# EasyEDA schematic Quadv4.json
TITLE: Quadruped Robot Main Controller; REV: 4.0; Sheet: 1/1
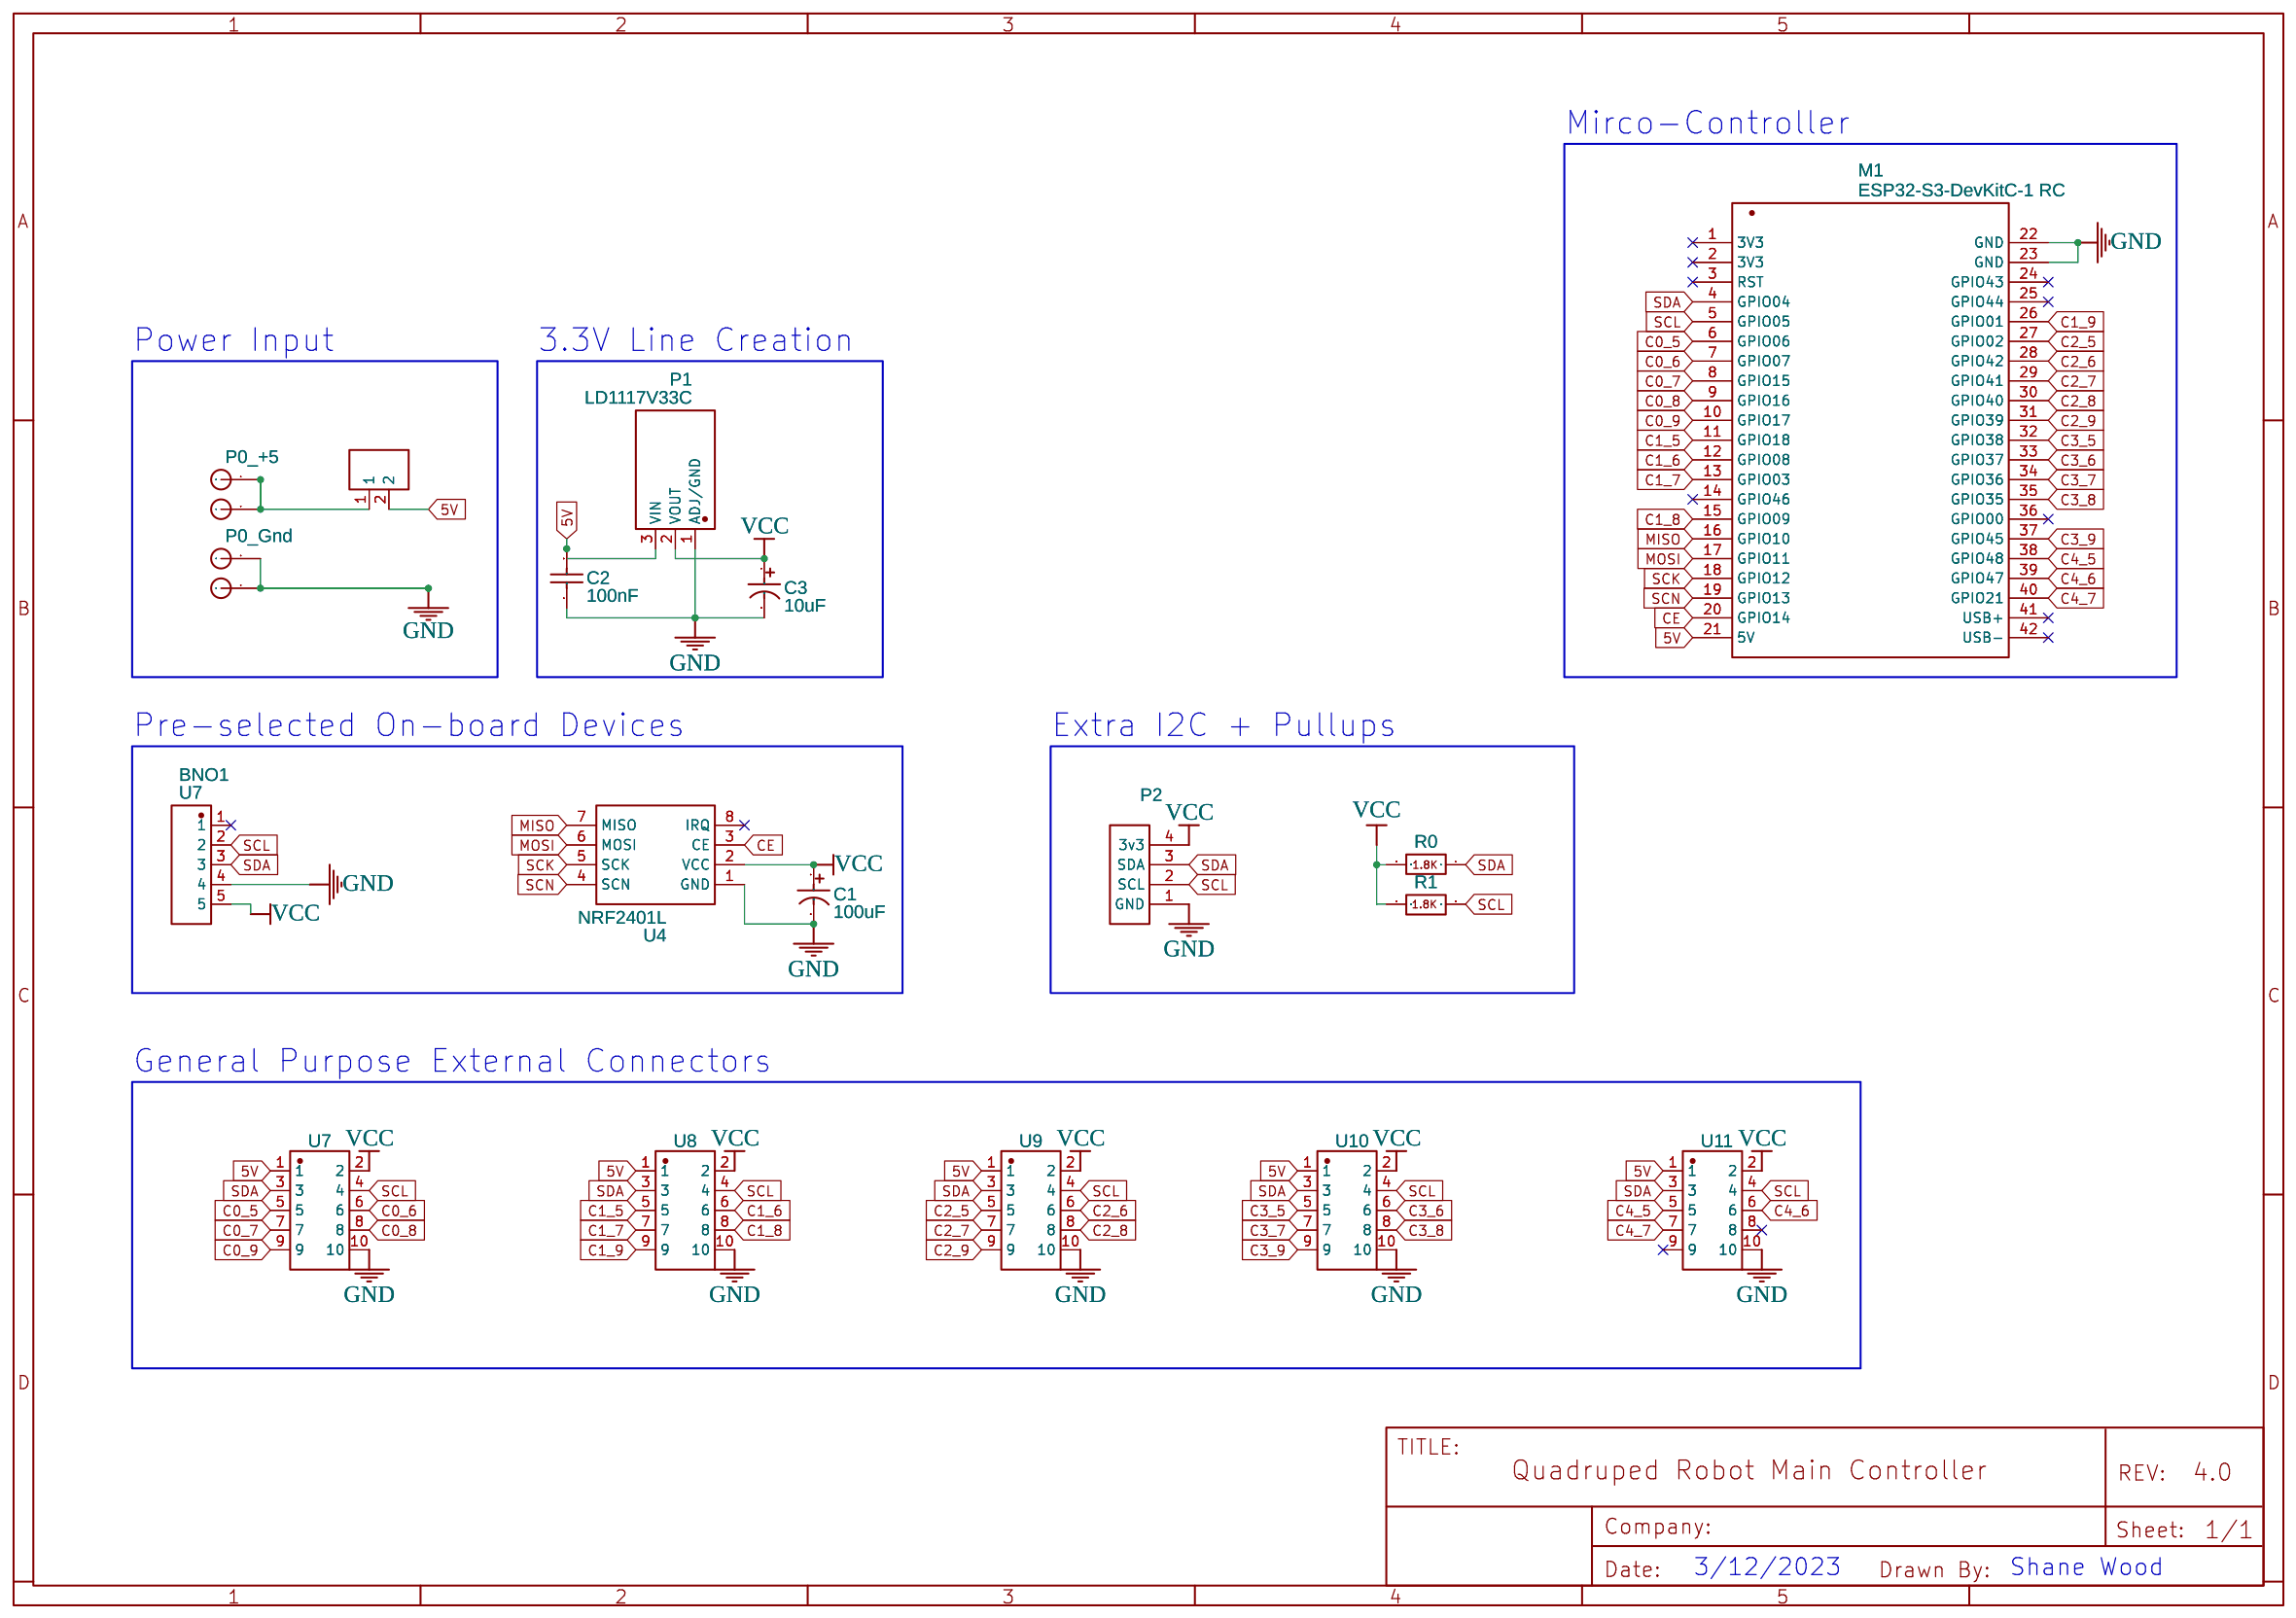
[diagram p0: schematic sheet]

## Parts
BNO1  U7  [CONN-TH_HDR-1X5]
C1  100uF  [100UFX16V CAPACITOR D5.0XF11.0]
C2  100nF  [100NF]
C3  10uF  [100UFX16V CAPACITOR D5.0XF11.0]
M1  ESP32-S3-DevKitC-1 RC  [ESP32-S2-DEVKITC-1]
P1  LD1117V33C  [ITO-220AB-3_L10.2-W4.5-P2.60-L]
P2  Connector_1x4/2.5mm  [HDR-1X4/2.54]
P3  Header-2.54_1x2  [HDR-1X2/2.54]
R1  R0  [1.8K RESISTOR 1/2W]
R2  R1  [1.8K RESISTOR 1/2W]
U1  NO  [14AWG PTH LARGE]
U2  P0_+5  [14AWG PTH LARGE]
U4  NRF2401L  [NRF2401L]
U5  NO  [14AWG PTH LARGE]
U6  P0_Gnd  [14AWG PTH LARGE]
U7  NO  [CONN-TH_10P-P2.54_KINGHELM_KH-2.54PH180-2X5P-L8.9]
U8  NO  [CONN-TH_10P-P2.54_KINGHELM_KH-2.54PH180-2X5P-L8.9]
U9  NO  [CONN-TH_10P-P2.54_KINGHELM_KH-2.54PH180-2X5P-L8.9]
U10  NO  [CONN-TH_10P-P2.54_KINGHELM_KH-2.54PH180-2X5P-L8.9]
U11  NO  [CONN-TH_10P-P2.54_KINGHELM_KH-2.54PH180-2X5P-L8.9]

## Library data of the parts
BNO1 = HDR-1X5.: Contributor: LCSC; Supplier: LCSC; Supplier Part: C2935751; Manufacturer: null; Manufacturer Part: HDR-1X5插件; JLCPCB Part Class: Extended Part; link: https://lcsc.com/eda_search?q=C2935751&%26type=1&ref=editor
C1 = CAP-POL-1: Supplier: My_collection; Manufacturer Part: Jweo; Rated Voltage: 16V; Contributor: stefanczykdk
C2 = 100NF COPY: Supplier: LCSC; Manufacturer: ReliaPro; Manufacturer Part: CT4-0805Y104M500; Contributor: LCSC; Supplier Part: C46756; subpart_no: 1
C3 = CAP 100 UF 2.5 MM KNIPEX: Supplier: My_collection; Manufacturer Part: Jweo; Rated Voltage: 16V; Contributor: stefanczykdk
M1 = ESP32-S2-DevKitC-1 RC: Manufacturer: Espressif Manifacturer; Manufacturer Part: ESP32-S3-DevKitC-1; Supplier: Mouser; Supplier Part: ESP32-S2-DevKitC-1; link: https://www.espressif.com/en/products/socs/esp32-s2; Contributor: remi_chamb; Package Display: No
P1 = LD1117V33C: Contributor: LCSC; Supplier: LCSC; Supplier Part: C672117; Manufacturer: ST(意法半导体); JLCPCB Part Class: Extended Part; link: https://lcsc.com/eda_search?q=C672117&%26type=1&ref=editor
P2 = Connector_1x4/2.5mm: Contributor: David Lochlin
P3 = Header-2.54_1x2: Manufacturer: BOOMELE; Manufacturer Part: 2.54-1*2PFemale; image: //image.lceda.cn/szlcsc/C49661.jpg; Supplier Part: C49661; Contributor: jccc2
R1 R2 = 1.8K_R_1/2W: Contributor: jokosays
U1 U2 U5 U6 = Wire Hole 14AWG: Manufacturer Part: Wire Hole; Contributor: dropTarget
U4 = NRF2401L: Manufacturer Part: nrf2401l; Contributor: freddyka
U7-U11 = KH-2.54PH180-2X5P: Supplier: LCSC; Supplier Part: C5157628; Manufacturer: kinghelm(金航标); Manufacturer Part: KH-2.54PH180-2X5P-L8.9; link: https://atta.szlcsc.com/upload/public/pdf/source/20220906/04BEB622ED10B556BB25C8F90E10FD05.pdf; Contributor: lcsc; JLCPCB Part Class: Extended Part

## Nets
5V: C2.2 M1.21(5V) P1.3(VIN) P3.2 U7.1 U8.1 U9.1 U10.1 U11.1
GND: BNO1.4 C1.2 C2.1 C3.2 M1.22(GND) M1.23(GND) P1.1(ADJ/GND) P2.1(GND) U4.1(GND) U5.1 U6.1 U7.10 U8.10 U9.10 U10.10 U11.10
VCC: BNO1.5 C1.1 C3.1 P1.2(VOUT) P2.4(3v3) R1.2 R2.1 U4.2(VCC) U7.2 U8.2 U9.2 U10.2 U11.2
C0_5: M1.6(GPIO06) U7.5
C0_6: M1.7(GPIO07) U7.6
C0_7: M1.8(GPIO15) U7.7
C0_8: M1.9(GPIO16) U7.8
C0_9: M1.10(GPIO17) U7.9
C1_5: M1.11(GPIO18) U8.5
C1_6: M1.12(GPIO08) U8.6
C1_7: M1.13(GPIO03) U8.7
C1_8: M1.15(GPIO09) U8.8
C1_9: M1.26(GPIO01) U8.9
C2_5: M1.27(GPIO02) U9.5
C2_6: M1.28(GPIO42) U9.6
C2_7: M1.29(GPIO41) U9.7
C2_8: M1.30(GPIO40) U9.8
C2_9: M1.31(GPIO39) U9.9
C3_5: M1.32(GPIO38) U10.5
C3_6: M1.33(GPIO37) U10.6
C3_7: M1.34(GPIO36) U10.7
C3_8: M1.35(GPIO35) U10.8
C3_9: M1.37(GPIO45) U10.9
C4_5: M1.38(GPIO48) U11.5
C4_6: M1.39(GPIO47) U11.6
C4_7: M1.40(GPIO21) U11.7
CE: M1.20(GPIO14) U4.3(CE)
MISO: M1.16(GPIO10) U4.7(MISO)
MOSI: M1.17(GPIO11) U4.6(MOSI)
SCK: M1.18(GPIO12) U4.5(SCK)
SCL: BNO1.2 M1.5(GPIO05) P2.2(SCL) R2.2 U7.4 U8.4 U9.4 U10.4 U11.4
SCN: M1.19(GPIO13) U4.4(SCN)
SDA: BNO1.3 M1.4(GPIO04) P2.3(SDA) R1.1 U7.3 U8.3 U9.3 U10.3 U11.3
Net-(P3-1): P3.1 U1.1 U2.1

Not connected (* = marked no-connect by the designer): BNO1 1*; M1 1(3V3)* 2(3V3)* 3(RST)* 14(GPIO46)* 24(GPIO43)* 25(GPIO44)* 36(GPIO00)* 41(USB+)* 42(USB-)*; U4 8(IRQ)*; U11 8* 9*

## Notes on the sheet
- Mirco-Controller
- Power Input
- 3.3V Line Creation
- Pre-selected On-board Devices
- Extra I2C + Pullups
- General Purpose External Connectors
- 3/12/2023
- Shane Wood
